# Altium project AMC_BOX_Panel.PrjPCB (part 2 of 2)

## Sheet IO.SchDoc
size A3
Used 2 times, as channels U_IO, U_IO. Parts and nets are listed once, with the designators drawn on the sheet.
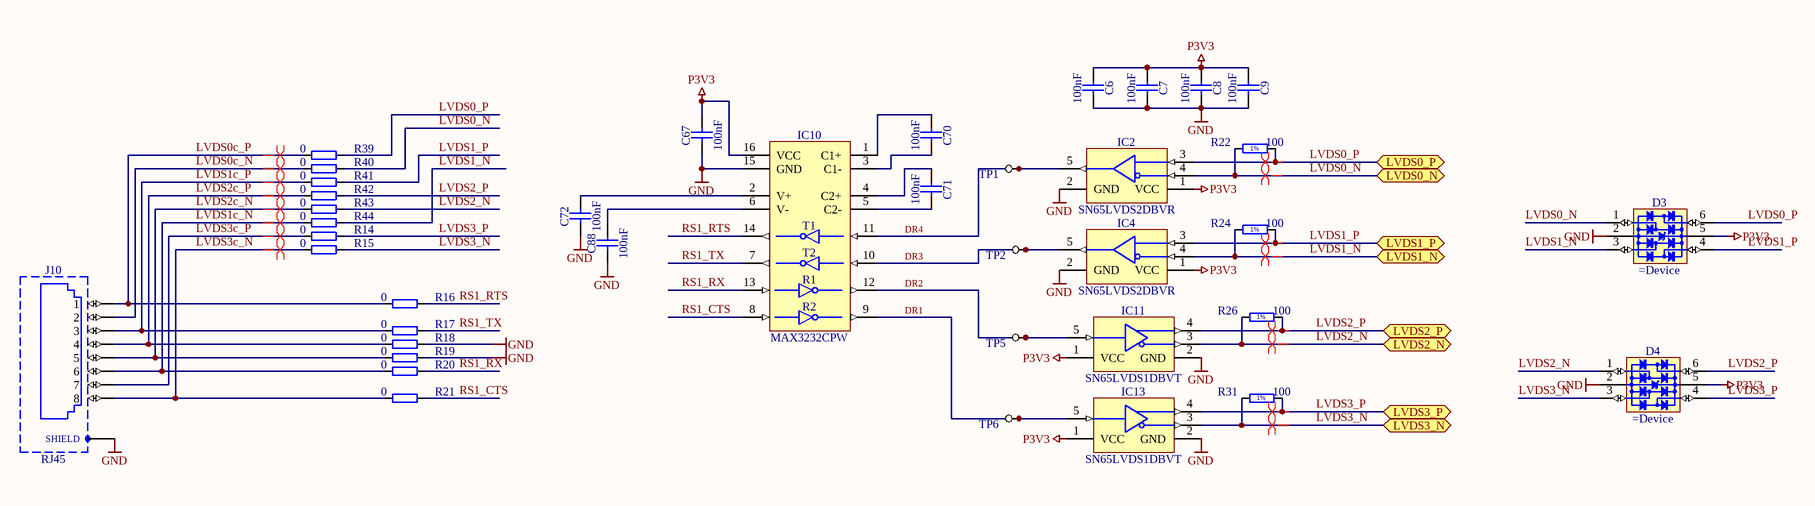
[diagram p4: IO.SchDoc]

### Parts
C6  100nF  [CAPC1005X55N]
C7  100nF  [CAPC1005X55N]
C8  100nF  [CAPC1005X55N]
C9  100nF  [CAPC1005X55N]
C67  100nF  [CAPC1005X55N]
C70  100nF  [CAPC1005X55N]
C71  100nF  [CAPC1005X55N]
C72  100nF  [CAPC1005X55N]
C88  100nF  [CAPC1005X55N]
D3  (no value)  [SOTFL50P160X60-6N]
D4  (no value)  [SOTFL50P160X60-6N]
IC2  SN65LVDS2DBVR  [SOT95P280X145-5N]
IC4  SN65LVDS2DBVR  [SOT95P280X145-5N]
IC10  MAX3232CPW  [SOP65P640X120-16N]
IC11  SN65LVDS1DBVT  [SOT95P280X145-5N]
IC13  SN65LVDS1DBVT  [SOT95P280X145-5N]
J10  RJ45  [FCI_95678-001LF]
R14  0  [RESC1005X40N]
R15  0  [RESC1005X40N]
R16  0  [RESC1005X40N]
R17  0  [RESC1005X40N]
R18  0  [RESC1005X40N]
R19  0  [RESC1005X40N]
R20  0  [RESC1005X40N]
R21  0  [RESC1005X40N]
R22  100  [RESC1005X40N]
R24  100  [RESC1005X40N]
R26  100  [RESC1005X40N]
R31  100  [RESC1005X40N]
R39  0  [RESC1005X40N]
R40  0  [RESC1005X40N]
R41  0  [RESC1005X40N]
R42  0  [RESC1005X40N]
R43  0  [RESC1005X40N]
R44  0  [RESC1005X40N]
TP1  TP  [TP]  (value not drawn)
TP2  TP  [TP]  (value not drawn)
TP5  TP  [TP]  (value not drawn)
TP6  TP  [TP]  (value not drawn)

### Ports
LVDS0_N (bidir), LVDS0_P (bidir), LVDS1_N (bidir), LVDS1_P (bidir), LVDS2_N (bidir), LVDS2_P (bidir), LVDS3_N (bidir), LVDS3_P (bidir)

### Nets
GND: C6.1 C7.1 C8.1 C9.1 C67.1 C72.2 C88.2 D3.2(GND) D4.2(GND) IC2.2(GND) IC4.2(GND) IC10.15(GND) IC11.2(GND) IC13.2(GND) J10.SHIELD R18.2 R19.2
P3V3: C6.2 C7.2 C8.2 C9.2 C67.2 D3.5(VBUS) D4.5(VBUS) IC2.1(VCC) IC4.1(VCC) IC10.16(VCC) IC11.1(VCC) IC13.1(VCC)
DR1: IC10.9(R2OUT) IC13.5(R) TP6.1
DR2: IC10.12(R1OUT) IC11.5(R) TP5.1
DR3: IC4.5(R) IC10.10(T2IN) TP2.1
DR4: IC2.5(R) IC10.11(T1IN) TP1.1
LVDS0_N: D3.1(I/O1) IC2.4(B) R22.1 R40.2 ; port LVDS0_N
LVDS0_P: D3.6(I/O4) IC2.3(A) R22.2 R39.2 ; port LVDS0_P
LVDS0c_N: J10.2 R40.1
LVDS0c_P: J10.1 R16.1 R39.1
LVDS1_N: D3.3(I/O2) IC4.4(B) R24.1 R44.2 ; port LVDS1_N
LVDS1_P: D3.4(I/O3) IC4.3(A) R24.2 R41.2 ; port LVDS1_P
LVDS1c_N: J10.6 R20.1 R44.1
LVDS1c_P: J10.3 R17.1 R41.1
LVDS2_N: D4.1(I/O1) IC11.3(A) R26.1 R43.2 ; port LVDS2_N
LVDS2_P: D4.6(I/O4) IC11.4(B) R26.2 R42.2 ; port LVDS2_P
LVDS2c_N: J10.5 R19.1 R43.1
LVDS2c_P: J10.4 R18.1 R42.1
LVDS3_N: D4.3(I/O2) IC13.3(A) R15.2 R31.1 ; port LVDS3_N
LVDS3_P: D4.4(I/O3) IC13.4(B) R14.2 R31.2 ; port LVDS3_P
LVDS3c_N: J10.8 R15.1 R21.1
LVDS3c_P: J10.7 R14.1
RS1_CTS: IC10.8(R2IN) R21.2
RS1_RTS: IC10.14(T1OUT) R16.2
RS1_RX: IC10.13(R1IN) R20.2
RS1_TX: IC10.7(T2OUT) R17.2
NetC70_1: C70.1 IC10.3(C1-)
NetC70_2: C70.2 IC10.1(C1+)
NetC71_1: C71.1 IC10.5(C2-)
NetC71_2: C71.2 IC10.4(C2+)
NetC72_1: C72.1 IC10.2(V+)
NetC88_1: C88.1 IC10.6(V-)

### Channels
U_IO: designators end in A; ports LVDS0_N=LVDS0_N LVDS0_P=LVDS0_P LVDS1_N=LVDS1_N LVDS1_P=LVDS1_P LVDS2_N=LVDS2_N LVDS2_P=LVDS2_P LVDS3_N=LVDS3_N LVDS3_P=LVDS3_P
U_IO: designators end in B; ports LVDS0_N=LVDS0_N LVDS0_P=LVDS0_P LVDS1_N=LVDS1_N LVDS1_P=LVDS1_P LVDS2_N=LVDS2_N LVDS2_P=LVDS2_P LVDS3_N=LVDS3_N LVDS3_P=LVDS3_P

### Layout directives
differential pair: LVDS0_N, LVDS0_P, LVDS0c_N_U_IO, LVDS0c_P_U_IO, LVDS1_N, LVDS1_P, LVDS1c_N_U_IO, LVDS1c_P_U_IO, LVDS2_N, LVDS2_P, LVDS2c_N_U_IO, LVDS2c_P_U_IO, LVDS3_N, LVDS3_P, LVDS3c_N_U_IO, LVDS3c_P_U_IO

### Notes on the sheet
- (in symbol MAX3232CPW) T1; T2; R1; R2
- (in symbol R0402_100R_1%_0.0625W_100PPM) 1%

### Library data of the parts
C6-C9 C67 C70-C72 C88 = CC0402_100NF_16V_10%_X5R: Non-polarised capacitor; Part Description: SMD Multilayer Chip Ceramic Capacitor; Manufacturer: GENERIC; Manufacturer1 Part Number: GRM155R61C104KA88D; Voltage: 16V; TC: X5R; Tolerance: ±10%; Part Number: CC0402_100NF_16V_10%_X5R; Component Kind: Standard; Component Type: Standard; Pin Count: 2; Value: 100nF; Status: None; Manufacturer Part Number: CC0402_100NF_16V_10%_X5R; Case: 0402; Mounted: Yes; Socket: No; SMD: Yes; Manufacturer1 Example: MURATA; Manufacturer1 ComponentHeight: 0.55mm; HelpURL: \\cern.ch\dfs\Applications\Altium\Datasheets\CC0402_X5R_MURATA_GRM.pdf; Author: CERN DEM JLC; CreateDate: 10.12.2013; LatestRevisionDate: 10.12.2013; Sense: No
D3 D4 = NUP4114UPXV6T1G: Part Number: NUP4114UPXV6T1G
IC2 IC4 = SN65LVDS2DBVR: High-Speed Differential Line Receiver; Manufacturer: TEXAS INSTRUMENTS; PressFit: No; Bonding: No; Part Number: SN65LVDS2DBVR; Component Kind: Standard; Component Type: Standard; Device: SN65LVDS2DBVR; PackageDescription: SOT, 0.95mm pitch; 5 pin, 1.60mm W X 2.90mm L X 1.45mm H body, IPC Medium Density; Part Description: High-Speed Differential Line Receiver; Manufacturer Part Number: SN65LVDS2DBVR; Pin Count: 5; Case: SOT23-5; Mounted: Yes; Socket: No; SMD: Yes; Sense: No; ComponentHeight: 1.45mm; Author: CERN DEM JLC; HelpURL: \\cern.ch\dfs\Applications\Altium\Datasheets\SN65LVDS2DBVR.pdf; CreateDate: 03.03.2011; LatestRevisionDate: 22.09.2011
IC10 = MAX3232CPW: 3-V To 5.5-V Multichannel RS-232 Line Driver/Receiver With ±15kV IEC ESD Protection; Part Description: 3V To 5.5V Multichannel RS-232 Line Driver/Receiver With ±15kV IEC ESD Protection; Manufacturer: TEXAS INSTRUMENTS; Table: Analog & Interface; Part Number: MAX3232CPW; Component Kind: Standard; Component Type: Standard; Device: MAX3232CPW; PackageDescription: SOP, 0.65mm pitch; 16 pin, 4.40mm W X 5.00mm L X 1.20mm H body IPC Medium Density; Manufacturer Part Number: MAX3232CPW; Pin Count: 16; Case: TSSOP16; Mounted: Yes; Socket: No; SMD: Yes; ComponentHeight: 1.2mm; Author: CERN DEM JLC; HelpURL: \\cern.ch\dfs\Applications\Altium\Datasheets\MAX3232CPW.pdf; CreateDate: 2012-01-09; LatestRevisionDate: 2012-01-10
IC11 IC13 = SN65LVDS1DBVT: High-Speed Differential Line Driver; Manufacturer: TEXAS INSTRUMENTS; PressFit: No; Bonding: No; Part Number: SN65LVDS1DBVT; Component Kind: Standard; Component Type: Standard; Device: SN65LVDS1DBVT; PackageDescription: SOT, 0.95mm pitch; 5 pin, 1.60mm W X 2.90mm L X 1.45mm H body, IPC Medium Density; Part Description: High-Speed Differential Line Driver; Manufacturer Part Number: SN65LVDS1DBVT; Pin Count: 5; Case: SOT23-5; Mounted: Yes; Socket: No; SMD: Yes; Sense: No; ComponentHeight: 1.45mm; Author: CERN DEM JLC; HelpURL: \\cern.ch\dfs\Applications\Altium\Datasheets\SN65LVDS1DBVT.pdf; CreateDate: 22.09.2011; LatestRevisionDate: 22.09.2011
J10 = FCI_95678-001LF: 1 Port, 8 Positions Shielded Snap PEG, CAT5 RJ45 Horizontal Modular Jack; Manufacturer: FCI; PressFit: No; Part Number: FCI_95678-001LF; Component Kind: Standard; Component Type: Standard; Pin Count: 10; Family: RJ45; Mounted: Yes; Socket: No; SMD: No; Sense: No; Status: None; Part Description: 1 Port, 8 Positions Shielded Snap PEG, CAT5 RJ45 Horizontal Modular Jack; Manufacturer Part Number: 95678-001LF; ComponentHeight: 13.99mm; HelpURL: \\cern.ch\dfs\Applications\Altium\Datasheets\FCI_95678-001LF.pdf; Author: CERN DEM BC; CreateDate: 28.07.2015; LatestRevisionDate: 28.07.2015
R14-R21 R39-R44 = R0402_0R_JUMPER: Resistor; Part Description: 1A (0.05R Max DC Resistance) Zero Ohm Jumper; Manufacturer: GENERIC; Manufacturer1 Part Number: 232270591001L; Table: Resistors SMD; Part Number: R0402_0R_JUMPER; Component Kind: Standard; Component Type: Standard; Pin Count: 2; Value: 0; Status: Not recommended; Manufacturer Part Number: R0402_0R_JUMPER; Case: 0402; Mounted: Yes; Socket: No; SMD: Yes; Manufacturer1 Example: YAGEO PHYCOMP; Manufacturer1 ComponentHeight: 0.4mm; HelpURL: \\cern.ch\dfs\Applications\Altium\Datasheets\R0402_Phycomp_RC0402.pdf; Author: CERN DEM JLC; CreateDate: 2007-12-03; LatestRevisionDate: 2012-10-17
R22 R24 R26 R31 = R0402_100R_1%_0.0625W_100PPM: Resistor - 1%; Part Description: General Purpose Thick Film Chip Resistor; Manufacturer: GENERIC; Manufacturer1 Part Number: 232270671001L; TC: ±100ppm/°C; Table: Resistors SMD; Part Number: R0402_100R_1%_0.0625W_100PPM; Component Kind: Standard; Component Type: Standard; Pin Count: 2; Value: 100; Status: Not recommended; Power: 0.0625W; Tolerance: ±1%; Manufacturer Part Number: R0402_100R_1%_0.0625W_100PPM; Case: 0402; Mounted: Yes; Socket: No; SMD: Yes; Manufacturer1 Example: YAGEO PHYCOMP; Manufacturer1 ComponentHeight: 0.4mm; HelpURL: \\cern.ch\dfs\Applications\Altium\Datasheets\R0402_Phycomp_RC0402.pdf; Author: CERN DEM JLC; CreateDate: 2007-12-03; LatestRevisionDate: 2012-10-17
TP1 TP2 TP5 TP6 = TP: Testpoint

## Sheet I2C_SW.SchDoc
size A4; Organization: Altium Limited; Address1: L3, 12a Rodborough Rd; Address2: Frenchs Forest; Address3: NSW; Address4: Australia 2086
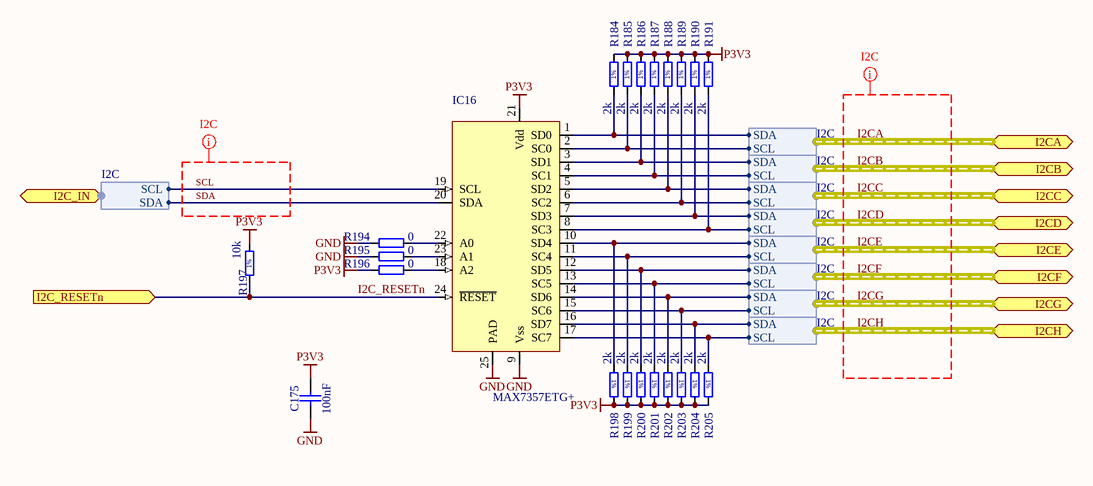
[diagram p5: I2C_SW.SchDoc]

### Parts
C175  100nF  [CAPC1005X55N]
IC16  MAX7357ETG+  [HVQFN24]
R184  2k  [RESC1005X40N]
R185  2k  [RESC1005X40N]
R186  2k  [RESC1005X40N]
R187  2k  [RESC1005X40N]
R188  2k  [RESC1005X40N]
R189  2k  [RESC1005X40N]
R190  2k  [RESC1005X40N]
R191  2k  [RESC1005X40N]
R194  0  [RESC1005X40N]
R195  0  [RESC1005X40N]
R196  0  [RESC1005X40N]
R197  10k  [RESC1005X40N]
R198  2k  [RESC1005X40N]
R199  2k  [RESC1005X40N]
R200  2k  [RESC1005X40N]
R201  2k  [RESC1005X40N]
R202  2k  [RESC1005X40N]
R203  2k  [RESC1005X40N]
R204  2k  [RESC1005X40N]
R205  2k  [RESC1005X40N]

### Ports
I2C_IN (harness I2C), I2C_RESETn (in), I2CA (harness I2C), I2CB (harness I2C), I2CC (harness I2C), I2CD (harness I2C), I2CE (harness I2C), I2CF (harness I2C), I2CG (harness I2C), I2CH (harness I2C)

### Harnesses
I2C: SCL, SDA

### Nets
GND: C175.1 IC16.9(Vss) IC16.25(PAD) R194.1 R195.1
P3V3: C175.2 IC16.21(Vdd) R184.2 R185.2 R186.2 R187.2 R188.2 R189.2 R190.2 R191.2 R196.1 R197.2 R198.2 R199.2 R200.2 R201.2 R202.2 R203.2 R204.2 R205.2
I2C_RESETn: IC16.24(~{RESET}) R197.1 ; port I2C_RESETn
I2CA.SCL: IC16.2(SC0) R185.1 ; port I2CA.SCL
I2CA.SDA: IC16.1(SD0) R184.1 ; port I2CA.SDA
I2CB.SCL: IC16.4(SC1) R187.1 ; port I2CB.SCL
I2CB.SDA: IC16.3(SD1) R186.1 ; port I2CB.SDA
I2CC.SCL: IC16.6(SC2) R189.1 ; port I2CC.SCL
I2CC.SDA: IC16.5(SD2) R188.1 ; port I2CC.SDA
I2CD.SCL: IC16.8(SC3) R191.1 ; port I2CD.SCL
I2CD.SDA: IC16.7(SD3) R190.1 ; port I2CD.SDA
I2CE.SCL: IC16.11(SC4) R199.1 ; port I2CE.SCL
I2CE.SDA: IC16.10(SD4) R198.1 ; port I2CE.SDA
I2CF.SCL: IC16.13(SC5) R201.1 ; port I2CF.SCL
I2CF.SDA: IC16.12(SD5) R200.1 ; port I2CF.SDA
I2CG.SCL: IC16.15(SC6) R203.1 ; port I2CG.SCL
I2CG.SDA: IC16.14(SD6) R202.1 ; port I2CG.SDA
I2CH.SCL: IC16.17(SC7) R205.1 ; port I2CH.SCL
I2CH.SDA: IC16.16(SD7) R204.1 ; port I2CH.SDA
SCL: IC16.19(SCL) ; port I2C_IN.SCL  [project net MSCL_L]
SDA: IC16.20(SDA) ; port I2C_IN.SDA  [project net MSDA_L]
NetIC16_18: IC16.18(A2) R196.2
NetIC16_22: IC16.22(A0) R194.2
NetIC16_23: IC16.23(A1) R195.2

### Buses and harness runs
harness I2CA = port I2CA
harness I2CB = port I2CB
harness I2CC = port I2CC
harness I2CD = port I2CD
harness I2CE = port I2CE
harness I2CF = port I2CF
harness I2CG = port I2CG
harness I2CH = port I2CH

### Layout directives
net class I2C: I2CA, I2CB, I2CC, I2CD, I2CE, I2CF, I2CG, I2CH, SCL, SDA

### Notes on the sheet
- (in symbol R0402_2K_1%_0.0625W_100PPM) 1%
- (in symbol R0402_10K_1%_0.0625W_100PPM) 1%

### Library data of the parts
C175 = CC0402_100NF_16V_10%_X5R: as C6 on sheet IO; Part Number: CC0402_100NF_16V_10%_X5R; Component Kind: Standard; Component Type: Standard; Pin Count: 2; Value: 100nF; Status: None; Manufacturer Part Number: CC0402_100NF_16V_10%_X5R; Case: 0402; Mounted: Yes; Socket: No; SMD: Yes; Manufacturer1 Example: MURATA; Manufacturer1 ComponentHeight: 0.55mm; HelpURL: \\cern.ch\dfs\Applications\Altium\Datasheets\CC0402_X5R_MURATA_GRM.pdf; Author: CERN DEM JLC; CreateDate: 10.12.2013; LatestRevisionDate: 10.12.2013; Sense: No
IC16 = IIC_MUX_MAX7357ETG+: 8-channel I2C-bus multiplexer with reset, INT and timeout
R184-R191 R198-R205 = R0402_2K_1%_0.0625W_100PPM: Resistor - 1%; Part Description: General Purpose Thick Film Chip Resistor; Manufacturer: GENERIC; Manufacturer1 Part Number: 232270672002L; TC: ±100ppm/°C; PressFit: No; Part Number: R0402_2K_1%_0.0625W_100PPM; Component Kind: Standard; Component Type: Standard; Pin Count: 2; Value: 2k; Status: Not Recommended; Power: 0.0625W; Tolerance: ±1%; Manufacturer Part Number: R0402_2K_1%_0.0625W_100PPM; Case: 0402; Mounted: Yes; Socket: No; SMD: Yes; Manufacturer1 Example: YAGEO PHYCOMP; Manufacturer1 ComponentHeight: 0.4mm; HelpURL: \\cern.ch\dfs\Applications\Altium\Datasheets\R0402_Phycomp_RC0402.pdf; Author: CERN DEM JLC; CreateDate: 03.12.2007; LatestRevisionDate: 17.10.2012; Sense: No
R194-R196 = R0402_0R_JUMPER: Resistor; Part Description: 1A (0.05R Max DC Resistance) Zero Ohm Jumper; Manufacturer: GENERIC; Manufacturer1 Part Number: 232270591001L; PressFit: No; Part Number: R0402_0R_JUMPER; Component Kind: Standard; Component Type: Standard; Pin Count: 2; Value: 0; Status: Not Recommended; Manufacturer Part Number: R0402_0R_JUMPER; Case: 0402; Mounted: Yes; Socket: No; SMD: Yes; Manufacturer1 Example: YAGEO PHYCOMP; Manufacturer1 ComponentHeight: 0.4mm; HelpURL: \\cern.ch\dfs\Applications\Altium\Datasheets\R0402_Phycomp_RC0402.pdf; Author: CERN DEM JLC; CreateDate: 03.12.2007; LatestRevisionDate: 17.10.2012; Sense: No
R197 = R0402_10K_1%_0.0625W_100PPM: Resistor - 1%; Part Description: General Purpose Thick Film Chip Resistor; Manufacturer: GENERIC; Manufacturer1 Part Number: 232270671003L; TC: ±100ppm/°C; Table: Resistors SMD; Part Number: R0402_10K_1%_0.0625W_100PPM; Component Kind: Standard; Component Type: Standard; Pin Count: 2; Value: 10k; Status: Not recommended; Power: 0.0625W; Tolerance: ±1%; Manufacturer Part Number: R0402_10K_1%_0.0625W_100PPM; Case: 0402; Mounted: Yes; Socket: No; SMD: Yes; Manufacturer1 Example: YAGEO PHYCOMP; Manufacturer1 ComponentHeight: 0.4mm; HelpURL: \\cern.ch\dfs\Applications\Altium\Datasheets\R0402_Phycomp_RC0402.pdf; Author: CERN DEM JLC; CreateDate: 2007-12-03; LatestRevisionDate: 2012-10-17

## Sheet Thermal_MGT.SchDoc
size A4
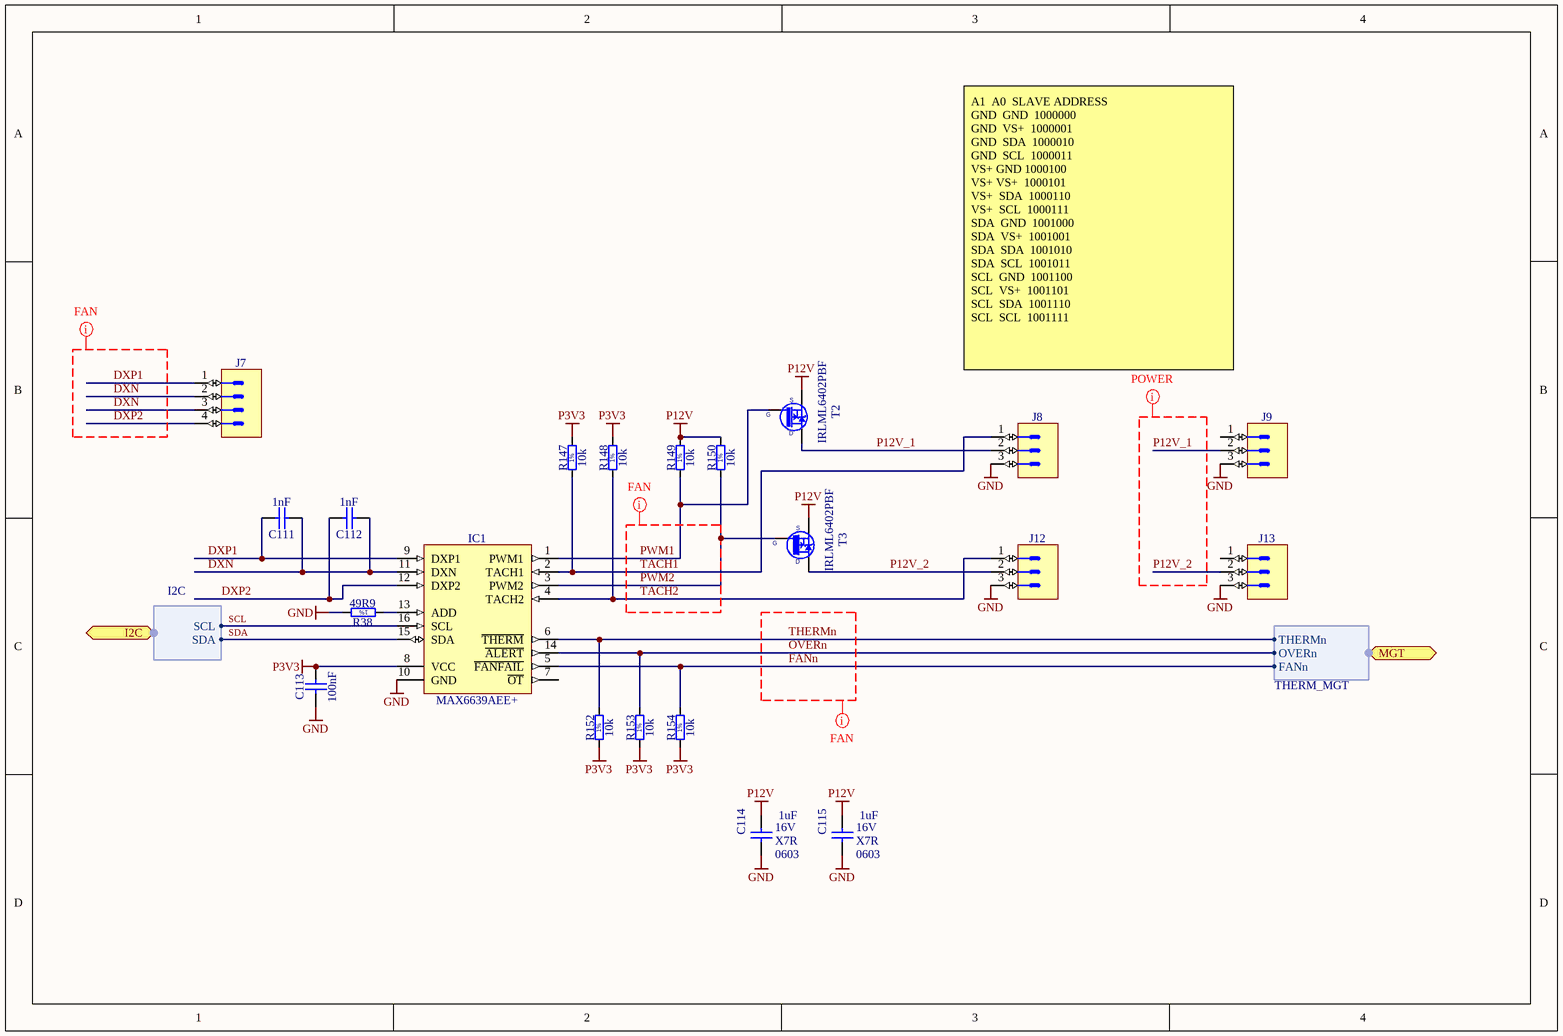
[diagram p6: Thermal_MGT.SchDoc]

### Parts
C111  1nF  [CAPC1005X55N]
C112  1nF  [CAPC1005X55N]
C113  100nF  [CAPC1005X55N]
C114  1uF  Voltage: 16V  TC: X7R  Case: 0603  [CAPC1608X87N]
C115  1uF  Voltage: 16V  TC: X7R  Case: 0603  [CAPC1608X87N]
IC1  MAX6639AEE+  [SOP63P600X175-16N]
J7  KK®  [MOLEX_22-27-2041]  (value not drawn)
J8  KK®  [MOLEX_22-05-7038]  (value not drawn)
J9  KK®  [MOLEX_22-05-7038]  (value not drawn)
J12  KK®  [MOLEX_22-05-7038]  (value not drawn)
J13  KK®  [MOLEX_22-05-7038]  (value not drawn)
R38  49R9  [RESC1005X40N]
R147  10k  [RESC1005X40N]
R148  10k  [RESC1005X40N]
R149  10k  [RESC1005X40N]
R150  10k  [RESC1005X40N]
R152  10k  [RESC1005X40N]
R153  10k  [RESC1005X40N]
R154  10k  [RESC1005X40N]
T2  IRLML6402PBF  [SOT95P237X112-3N]
T3  IRLML6402PBF  [SOT95P237X112-3N]

### Ports
I2C (harness I2C), MGT (harness THERM_MGT)

### Harnesses
I2C: SCL, SDA
THERM_MGT: OVERn, THERMn, FANn

### Nets
GND: C113.1 C114.1 C115.1 IC1.10(GND) J8.3 J9.3 J12.3 J13.3 R38.2
P3V3: C113.2 IC1.8(VCC) R147.2 R148.2 R152.1 R153.1 R154.1
P12V: C114.2 C115.2 R149.2 R150.2 T2.2(S) T3.2(S)
DXN: C111.1 C112.1 IC1.11(DXN) J7.2 J7.3
DXP1: C111.2 IC1.9(DXP1) J7.1
DXP2: C112.2 IC1.12(DXP2) J7.4
FANn: IC1.5(~{FANFAIL}) R154.2 ; port MGT.FANn
OVERn: IC1.14(~{ALERT}) R153.2 ; port MGT.OVERn
P12V_1: J8.2 J9.2 T2.3(D)
P12V_2: J12.2 J13.2 T3.3(D)
PWM1: IC1.1(PWM1) R149.1 T2.1(G)
PWM2: IC1.3(PWM2) R150.1 T3.1(G)
SCL: IC1.16(SCL) ; port I2C.SCL  [project net I2CH.SCL]
SDA: IC1.15(SDA) ; port I2C.SDA  [project net I2CH.SDA]
TACH1: IC1.2(TACH1) J8.1 R147.1
TACH2: IC1.4(TACH2) J12.1 R148.1
THERMn: IC1.6(~{THERM}) R152.2 ; port MGT.THERMn
NetIC1_13: IC1.13(ADD) R38.1

Not connected (* = marked no-connect by the designer): IC1 7(~{OT}); J9 1; J13 1

### Layout directives
net class POWER: P12V_1, P12V_2
net class FAN: DXN, DXP1, DXP2, FANn, OVERn, PWM1, PWM2, TACH1, TACH2, THERMn

### Notes on the sheet
- A1 	A0 	SLAVE ADDRESS
  GND 	GND 	1000000
  GND 	VS+ 	1000001
  GND 	SDA 	1000010
  GND 	SCL 	1000011
  VS+	GND	1000100
  VS+	VS+ 	1000101
  VS+ 	SDA 	1000110
  VS+ 	SCL 	1000111
  SDA 	GND 	1001000
  SDA 	VS+ 	1001001
  SDA 	SDA 	1001010
  SDA 	SCL 	1001011
  SCL 	GND 	1001100
  SCL 	VS+ 	1001101
  SCL 	SDA 	1001110
  SCL 	SCL 	1001111
- (in symbol R0402_10K_1%_0.0625W_100PPM) 1%
- (in symbol R0402_49R9_1%_0.0625W_100PPM) 1%

### Library data of the parts
C111 C112 = CC0402_1NF_50V_10%_X7R: Non-polarised capacitor; Part Description: SMD Multilayer Chip Ceramic Capacitor; Manufacturer: GENERIC; Manufacturer1 Part Number: 223858715623; Voltage: 50V; TC: X7R; Tolerance: ±10%; Part Number: CC0402_1NF_50V_10%_X7R; Component Kind: Standard; Component Type: Standard; Pin Count: 2; Value: 1nF; Status: Not Recommended; Manufacturer Part Number: CC0402_1NF_50V_10%_X7R; Case: 0402; Mounted: Yes; Socket: No; SMD: Yes; Manufacturer1 Example: PHYCOMP; Manufacturer1 ComponentHeight: 0.55mm; HelpURL: \\cern.ch\dfs\Applications\Altium\Datasheets\CC0402_X7R_PHYCOMP.pdf; Author: CERN DEM JLC; CreateDate: 03.12.2007; LatestRevisionDate: 03.12.2007; Sense: No
C113 = CC0402_100NF_16V_10%_X5R: as C6 on sheet IO; Part Number: CC0402_100NF_16V_10%_X5R; Component Kind: Standard; Component Type: Standard; Pin Count: 2; Value: 100nF; Status: None; Manufacturer Part Number: CC0402_100NF_16V_10%_X5R; Case: 0402; Mounted: Yes; Socket: No; SMD: Yes; Manufacturer1 Example: MURATA; Manufacturer1 ComponentHeight: 0.55mm; HelpURL: \\cern.ch\dfs\Applications\Altium\Datasheets\CC0402_X5R_MURATA_GRM.pdf; Author: CERN DEM JLC; CreateDate: 10.12.2013; LatestRevisionDate: 10.12.2013; Sense: No
C114 C115 = CC0603_1UF_16V_10%_X7R: Non-polarised capacitor; Part Description: SMD Multilayer Chip Ceramic Capacitor; Manufacturer: GENERIC; Manufacturer1 Part Number: 223824613663; Tolerance: ±10%; Table: Capacitors SMD; Part Number: CC0603_1UF_16V_10%_X7R; Component Kind: Standard; Component Type: Standard; Pin Count: 2; Value: 1uF; Status: Preferred; Manufacturer Part Number: CC0603_1uF_16V_10%_X7R; Mounted: Yes; Socket: No; SMD: Yes; Manufacturer1 Example: PHYCOMP; Manufacturer1 ComponentHeight: 0.87mm; HelpURL: \\cern.ch\dfs\Applications\Altium\Datasheets\CC0805_X5R_PHYCOMP_HC.pdf; Author: CERN DEM JLC; CreateDate: 12/3/2007; LatestRevisionDate: 12/3/2007
IC1 = MAX6639AEE+: 2-Channel Temperature Monitor with Dual, Automatic, PWM Fan-Speed Controller; Manufacturer: MAXIM; Table: Analog & Interface; Part Number: MAX6639AEE+; Component Kind: Standard; Component Type: Standard; Device: MAX6639AEE+; PackageDescription: SOP, 0.635mm pitch; 16 pin, 3.9mm W X 4.895mm L X 1.75mm H Body, IPC Medium Density; Part Description: 2-Channel Temperature Monitor with Dual, Automatic, PWM Fan-Speed Controller; Manufacturer Part Number: MAX6639AEE+; Pin Count: 16; Case: SSOP16; Mounted: Yes; Socket: No; SMD: Yes; ComponentHeight: 1.75mm; Author: CERN DEM JLC; HelpURL: \\cern.ch\dfs\Applications\Altium\Datasheets\MAX6639AEE+.pdf; CreateDate: 2012-08-15; LatestRevisionDate: 2012-08-15
J7 = MOLEX_22-27-2041: Connector 4 Male; Part Description: 2.54mm (.100") Pitch KK® Wire-to-Board Header, Vertical, with Friction Lock, 4 Circuits, Tin (Sn) Plating; Manufacturer: MOLEX; PressFit: No; Part Number: MOLEX_22-27-2041; Component Kind: Standard; Component Type: Standard; Pin Count: 4; Family: KK®; Mounted: Yes; Socket: No; SMD: No; Sense: No; Status: None; Manufacturer Part Number: 22-27-2041; ComponentHeight: 11.7mm; HelpURL: \\cern.ch\dfs\Applications\Altium\Datasheets\MOLEX_22-27-2041.pdf; Author: CERN DEM JLC; CreateDate: 04.12.2008; LatestRevisionDate: 04.12.2008
J8 J9 J12 J13 = MOLEX_22-05-7038: Connector 3 Male; Part Description: 2.54mm (.100") Pitch KK® Wire-To-Board Header, Right Angle, With Friction Lock, 3 Circuits; Manufacturer: MOLEX; PressFit: No; Part Number: MOLEX_22-05-7038; Component Kind: Standard; Component Type: Standard; Pin Count: 3; Family: KK®; Mounted: Yes; Socket: No; SMD: No; Sense: No; Status: None; Manufacturer Part Number: 22-05-7038; ComponentHeight: 5.8mm; HelpURL: \\cern.ch\dfs\Applications\Altium\Datasheets\MOLEX_22-05-7038.pdf; Author: CERN DEM JLC; CreateDate: 19.09.2012; LatestRevisionDate: 19.09.2012
R38 = R0402_49R9_1%_0.0625W_100PPM: Resistor - 1%; Part Description: General Purpose Thick Film Chip Resistor; Manufacturer: GENERIC; Manufacturer1 Part Number: 232270674999L or RC0402FR-0749R9L; TC: ±100ppm/°C; Table: Resistors SMD; Part Number: R0402_49R9_1%_0.0625W_100PPM; Component Kind: Standard; Component Type: Standard; Pin Count: 2; Value: 49R9; Status: Not recommended; Power: 0.0625W; Tolerance: ±1%; Manufacturer Part Number: R0402_49R9_1%_0.0625W_100PPM; Case: 0402; Mounted: Yes; Socket: No; SMD: Yes; Manufacturer1 Example: YAGEO PHYCOMP; Manufacturer1 ComponentHeight: 0.4mm; HelpURL: \\cern.ch\dfs\Applications\Altium\Datasheets\R0402_Phycomp_RC0402.pdf; Author: CERN DEM JLC; CreateDate: 2012-10-24; LatestRevisionDate: 2012-10-24
R147-R150 R152-R154 = R0402_10K_1%_0.0625W_100PPM: as R197 on sheet I2C_SW; Part Number: R0402_10K_1%_0.0625W_100PPM; Component Kind: Standard; Component Type: Standard; Pin Count: 2; Value: 10k; Status: Not recommended; Power: 0.0625W; Tolerance: ±1%; Manufacturer Part Number: R0402_10K_1%_0.0625W_100PPM; Case: 0402; Mounted: Yes; Socket: No; SMD: Yes; Manufacturer1 Example: YAGEO PHYCOMP; Manufacturer1 ComponentHeight: 0.4mm; HelpURL: \\cern.ch\dfs\Applications\Altium\Datasheets\R0402_Phycomp_RC0402.pdf; Author: CERN DEM JLC; CreateDate: 2007-12-03; LatestRevisionDate: 2012-10-17
T2 T3 = IRLML6402PBF: P-CHANNEL MOSFET WITH ZENER DIODE; Part Description: -20V -3.7A P-Channel HEXFET® Power MOSFET; Manufacturer: INTERNATIONAL RECTIFIER; PressFit: No; Bonding: No; Part Number: IRLML6402PBF; Component Kind: Standard; Component Type: Standard; Device: IRLML6402PBF; PackageDescription: SOT, 0.95mm, pitch; 3 pin,1.30mm W X 2.92mm L X 1.12mm H body, IPC Medium Density; Manufacturer Part Number: IRLML6402PBF; Pin Count: 3; Case: SOT23-3; Mounted: Yes; Socket: No; SMD: Yes; Sense: No; ComponentHeight: 1.12mm; HelpURL: \\cern.ch\dfs\Applications\Altium\Datasheets\IRLML6402PBF.pdf; Author: CERN DEM JLC; CreateDate: 8/29/2011; LatestRevisionDate: 8/29/2011

## Sheet CPU_ETH.SchDoc
size A3
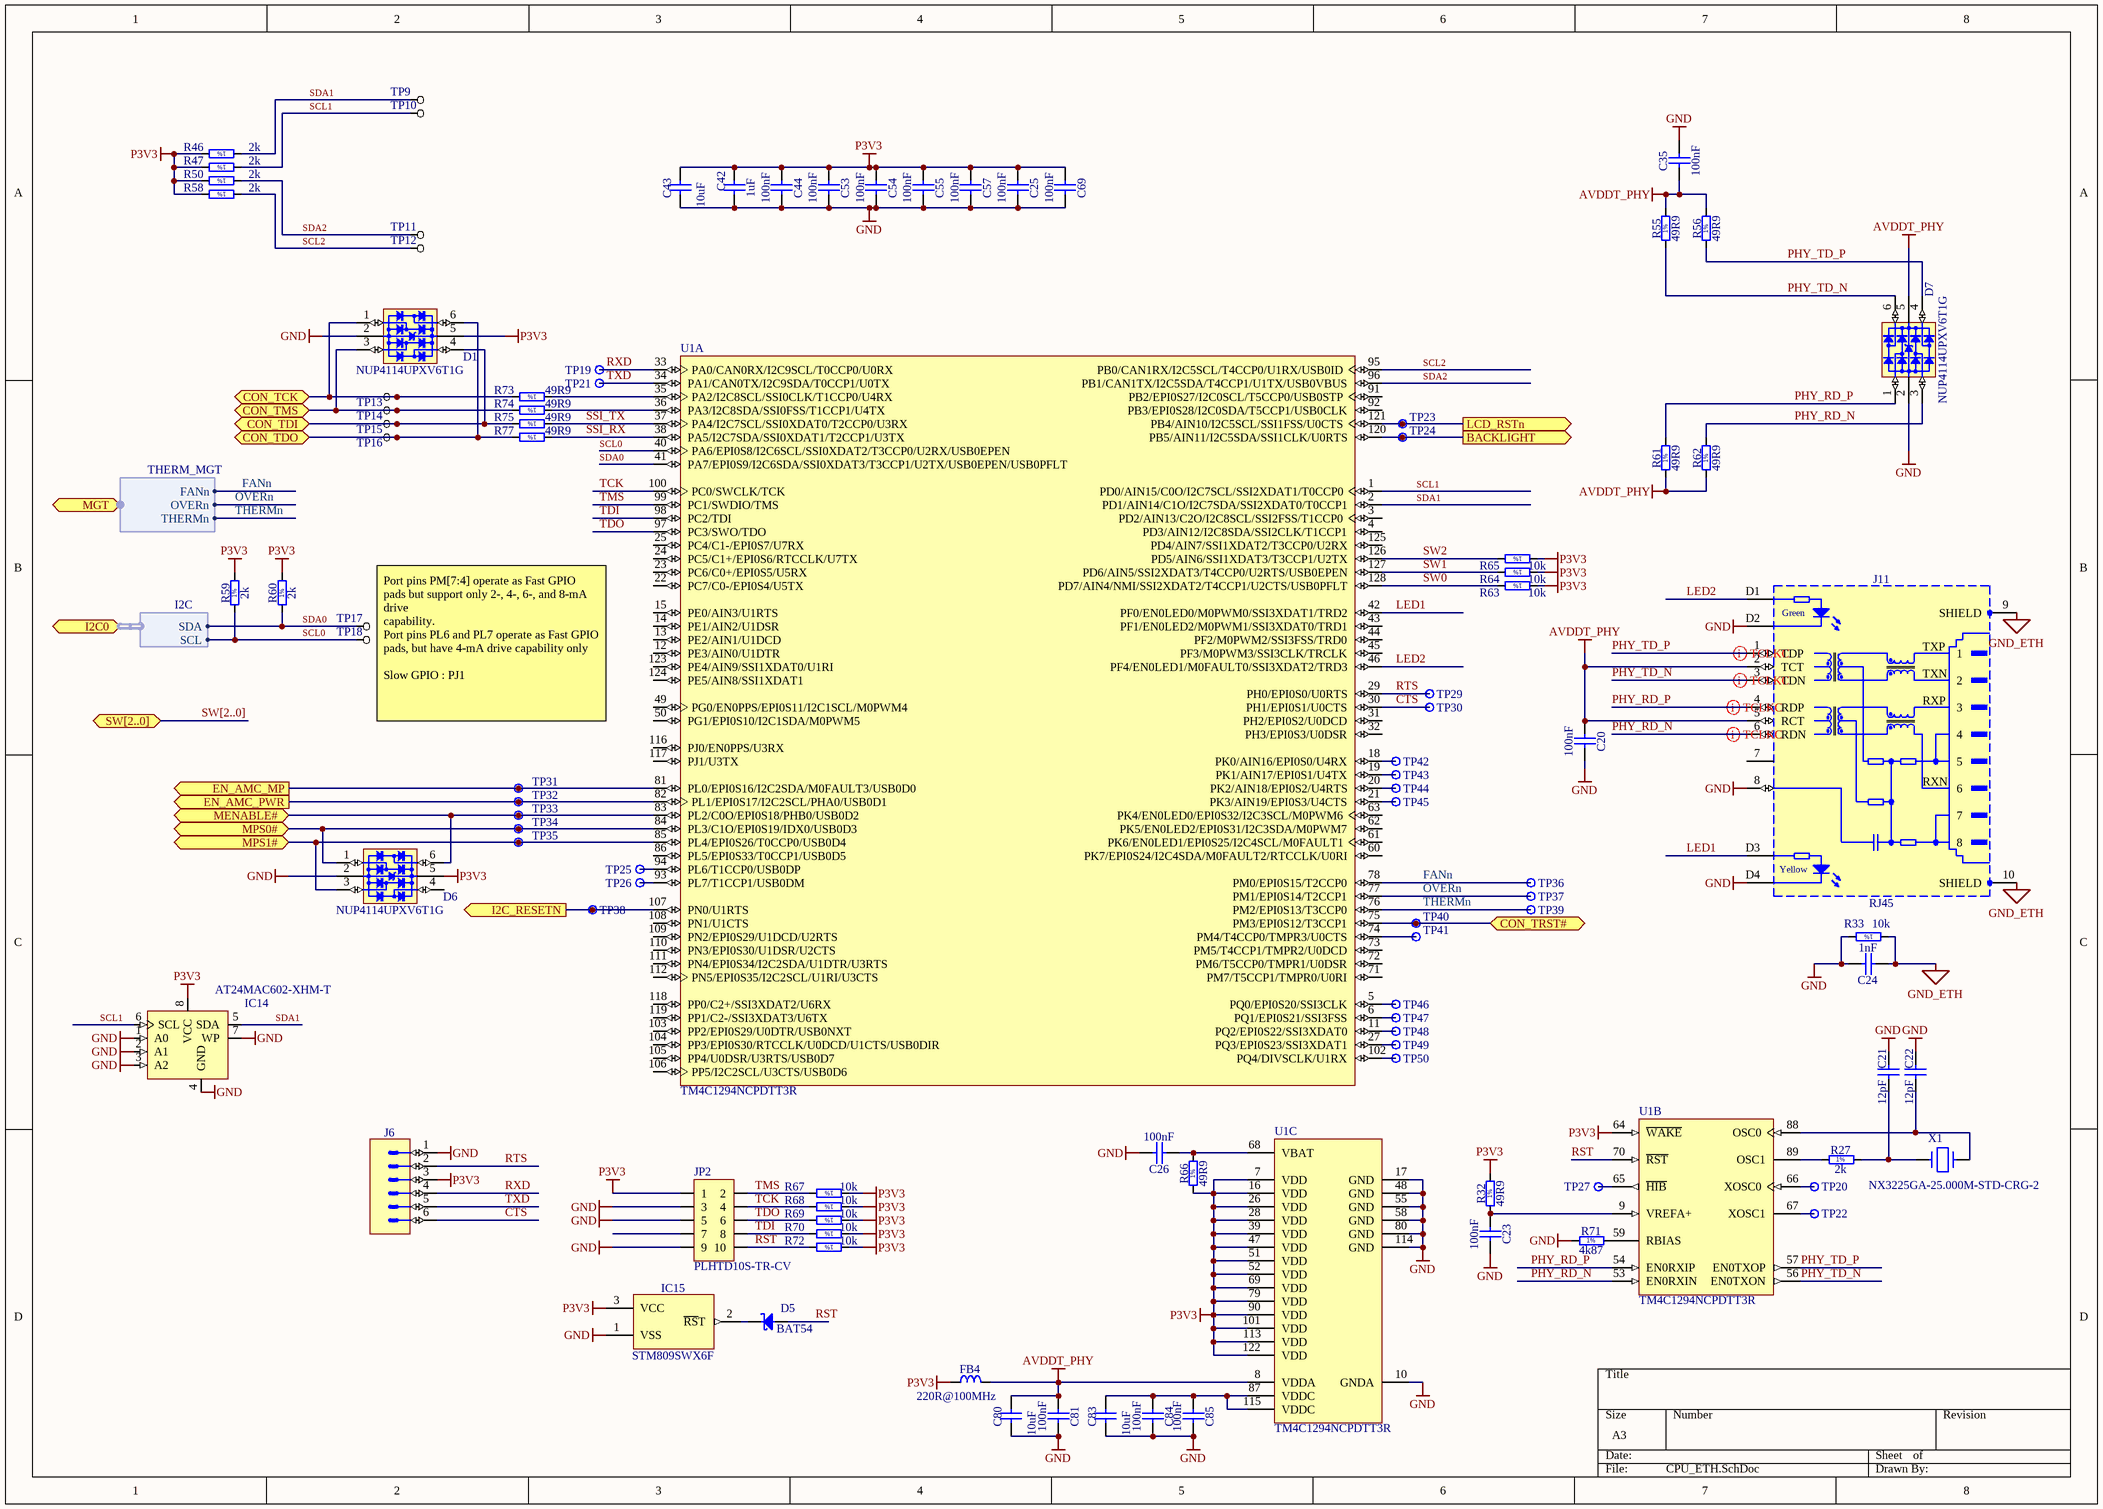
[diagram p7: CPU_ETH.SchDoc]

### Parts
(Parts that share a designator on the sheet are numbered #1, #2 ... from top to bottom, then left to right.)
C20  100nF  [CAPC1005X55N]
C21  12pF  [CAPC1005X55N]
C22  12pF  [CAPC1005X55N]
C23  100nF  [CAPC1005X55N]
C24  1nF  [CAPC1005X55N]
C25  100nF  [CAPC1005X55N]
C26  100nF  [CAPC1005X55N]
C35  100nF  [CAPC1005X55N]
C42  1uF  [CAPC1608X87N]
C43  10uF  [CAPC2012X135N]
C44  100nF  [CAPC1005X55N]
C53  100nF  [CAPC1005X55N]
C54  100nF  [CAPC1005X55N]
C55  100nF  [CAPC1005X55N]
C57  100nF  [CAPC1005X55N]
C69  100nF  [CAPC1005X55N]
C80  10uF  [CAPC2012X135N]
C81  100nF  [CAPC1005X55N]
C83  10uF  [CAPC2012X135N]
C84  100nF  [CAPC1005X55N]
C85  100nF  [CAPC1005X55N]
D1  NUP4114UPXV6T1G  [SOTFL50P160X60-6N]
D5  BAT54  [SOT95P240X130-3N]
D6  NUP4114UPXV6T1G  [SOTFL50P160X60-6N]
D7  NUP4114UPXV6T1G  [SOTFL50P160X60-6N]
FB4  220R@100MHz  [INDC2012X105N]
IC14  AT24MAC602-XHM-T  [TSSOP-8]
IC15  STM809SWX6F  [SOT95P237X112-3N]
J6  KK®  [MOLEX_22-27-2061]  (value not drawn)
J11  RJ45  [TYCO_5-6605308-1]
JP2  PLHTD10S-TR-CV  [PLHTD10S-TR-CV]
R27  2k  [RESC1005X40N]
R32  49R9  [RESC1005X40N]
R33  10k  [RESC1005X40N]
R46  2k  [RESC1005X40N]
R47  2k  [RESC1005X40N]
R50  2k  [RESC1005X40N]
R55  49R9  [RESC1005X40N]
R56  49R9  [RESC1005X40N]
R58  2k  [RESC1005X40N]
R59  2k  [RESC1005X40N]
R60  2k  [RESC1005X40N]
R61  49R9  [RESC1005X40N]
R62  49R9  [RESC1005X40N]
R63  10k  [RESC1005X40N]
R64  10k  [RESC1005X40N]
R65  10k  [RESC1005X40N]
R66  49R9  [RESC1005X40N]
R67  10k  [RESC1005X40N]
R68  10k  [RESC1005X40N]
R69  10k  [RESC1005X40N]
R70  10k  [RESC1005X40N]
R71  4k87  [RESC1005X40N]
R72  10k  [RESC1005X40N]
R73  49R9  [RESC1005X40N]
R74  49R9  [RESC1005X40N]
R75  49R9  [RESC1005X40N]
R77  49R9  [RESC1005X40N]
TP9  TP  [TP]  (value not drawn)
TP10  TP  [TP]  (value not drawn)
TP11  TP  [TP]  (value not drawn)
TP12  TP  [TP]  (value not drawn)
TP13  TP  [TP]  (value not drawn)
TP14  TP  [TP]  (value not drawn)
TP15  TP  [TP]  (value not drawn)
TP16  TP  [TP]  (value not drawn)
TP17  TP  [TP]  (value not drawn)
TP18  TP  [TP]  (value not drawn)
TP19  Test Point  [TPS127]  (value not drawn)
TP20  Test Point  [TPS127]  (value not drawn)
TP21  Test Point  [TPS127]  (value not drawn)
TP22  Test Point  [TPS127]  (value not drawn)
TP23  Test Point  [TPS127]  (value not drawn)
TP24  Test Point  [TPS127]  (value not drawn)
TP25  Test Point  [TPS127]  (value not drawn)
TP26  Test Point  [TPS127]  (value not drawn)
TP27  Test Point  [TPS127]  (value not drawn)
TP29  Test Point  [TPS127]  (value not drawn)
TP30  Test Point  [TPS127]  (value not drawn)
TP31  Test Point  [TPS127]  (value not drawn)
TP32  Test Point  [TPS127]  (value not drawn)
TP33  Test Point  [TPS127]  (value not drawn)
TP34  Test Point  [TPS127]  (value not drawn)
TP35  Test Point  [TPS127]  (value not drawn)
TP36  Test Point  [TPS127]  (value not drawn)
TP37  Test Point  [TPS127]  (value not drawn)
TP38  Test Point  [TPS127]  (value not drawn)
TP39  Test Point  [TPS127]  (value not drawn)
TP40  Test Point  [TPS127]  (value not drawn)
TP41  Test Point  [TPS127]  (value not drawn)
TP42  Test Point  [TPS127]  (value not drawn)
TP43  Test Point  [TPS127]  (value not drawn)
TP44  Test Point  [TPS127]  (value not drawn)
TP45  Test Point  [TPS127]  (value not drawn)
TP46  Test Point  [TPS127]  (value not drawn)
TP47  Test Point  [TPS127]  (value not drawn)
TP48  Test Point  [TPS127]  (value not drawn)
TP49  Test Point  [TPS127]  (value not drawn)
TP50  Test Point  [TPS127]  (value not drawn)
U1#1  TM4C1294NCPDTT3R  [PDT0128A_N]  (part A of 3)
U1#2  TM4C1294NCPDTT3R  [PDT0128A_N]  (parts B,C of 3)
X1  NX3225GA-25.000M-STD-CRG-2  [XTAL_5.0*3.2]

### Ports
BACKLIGHT (out), CON_TCK (bidir), CON_TDI (bidir), CON_TDO (bidir), CON_TMS (bidir), CON_TRST#, EN_AMC_MP (out), EN_AMC_PWR (out), I2C0 (harness I2C), I2C_RESETN (out), LCD_RSTn (out), MENABLE# (bidir), MGT (harness THERM_MGT), MPS0# (bidir), MPS1# (bidir), SW[2..0] (bidir)

### Harnesses
THERM_MGT: OVERn, THERMn, FANn
I2C: SCL, SDA

### Nets
AVDDT_PHY: C20.2 C35.1 C80.1 C81.2 D7.5(VBUS) FB4.2 J11.2(TCT) J11.5(RCT) R55.2 R56.2 R61.1 R62.1 U1#2.8(VDDA)
GND: C20.1 C21.2 C22.2 C23.1 C24.2 C25.1 C26.1 C35.2 C42.1 C43.2 C44.1 C53.1 C54.1 C55.1 C57.1 C69.1 C80.2 C81.1 C83.2 C84.1 C85.1 D1.2(GND) D6.2(GND) D7.2(GND) IC14.1(A0) IC14.2(A1) IC14.3(A2) IC14.4(GND) IC14.7(WP) IC15.1(VSS) J6.1 J11.8 J11.D2 J11.D4 JP2.3 JP2.5 JP2.9 R33.2 R71.1 U1#2.10(GNDA) U1#2.17(GND) U1#2.48(GND) U1#2.55(GND) U1#2.58(GND) U1#2.80(GND) U1#2.114(GND)
GND_ETH: C24.1 J11.9(SHIELD) J11.10(SHIELD) R33.1
P3V3: C25.2 C42.2 C43.1 C44.2 C53.2 C54.2 C55.2 C57.2 C69.2 D1.5(VBUS) D6.5(VBUS) FB4.1 IC14.8(VCC) IC15.3(VCC) J6.3 JP2.1 R32.2 R46.2 R47.2 R50.2 R58.2 R59.2 R60.2 R63.1 R64.1 R65.1 R66.1 R67.1 R68.1 R69.1 R70.1 R72.1 U1#2.7(VDD) U1#2.16(VDD) U1#2.26(VDD) U1#2.28(VDD) U1#2.39(VDD) U1#2.47(VDD) U1#2.51(VDD) U1#2.52(VDD) U1#2.64(~{WAKE}) U1#2.69(VDD) U1#2.79(VDD) U1#2.90(VDD) U1#2.101(VDD) U1#2.113(VDD) U1#2.122(VDD)
Backlight: TP24.1 U1#1.120(PB5/AIN11/I2C5SDA/SSI1CLK/U0RTS) ; port BACKLIGHT
CON_TCK: D1.1(I/O1) R73.2 TP13.1 ; port CON_TCK
CON_TDI: D1.4(I/O3) R75.2 TP15.1 ; port CON_TDI
CON_TDO: D1.6(I/O4) R77.2 TP16.1 ; port CON_TDO
CON_TMS: D1.3(I/O2) R74.2 TP14.1 ; port CON_TMS
CON_TRST#: TP40.1 U1#1.75(PM3/EPI0S12/T3CCP1) ; port CON_TRST#
CTS: J6.6 TP30.1 U1#1.30(PH1/EPI0S1/U0CTS)
EN_AMC_MP: TP31.1 U1#1.81(PL0/EPI0S16/I2C2SDA/M0FAULT3/USB0D0) ; port EN_AMC_MP
EN_AMC_PWR: TP32.1 U1#1.82(PL1/EPI0S17/I2C2SCL/PHA0/USB0D1) ; port EN_AMC_PWR
FANn: TP36.1 U1#1.78(PM0/EPI0S15/T2CCP0) ; port MGT.FANn
I2C_RESETn: TP38.1 U1#1.107(PN0/U1RTS) ; port I2C_RESETN
LCD_RSTn: TP23.1 U1#1.121(PB4/AIN10/I2C5SCL/SSI1FSS/U0CTS) ; port LCD_RSTn
LED1: J11.D3 U1#1.42(PF0/EN0LED0/M0PWM0/SSI3XDAT1/TRD2)
LED2: J11.D1 U1#1.46(PF4/EN0LED1/M0FAULT0/SSI3XDAT2/TRD3)
MENABLE#: D6.6(I/O4) TP33.1 U1#1.83(PL2/C0O/EPI0S18/PHB0/USB0D2) ; port MENABLE#
MPS0#: D6.1(I/O1) TP34.1 U1#1.84(PL3/C1O/EPI0S19/IDX0/USB0D3) ; port MPS0#
MPS1#: D6.3(I/O2) TP35.1 U1#1.85(PL4/EPI0S26/T0CCP0/USB0D4) ; port MPS1#
OVERn: TP37.1 U1#1.77(PM1/EPI0S14/T2CCP1) ; port MGT.OVERn
PHY_RD_N: D7.3(I/O2) J11.6(RDN) R62.2 U1#2.53(EN0RXIN)
PHY_RD_P: D7.1(I/O1) J11.4(RDP) R61.2 U1#2.54(EN0RXIP)
PHY_TD_N: D7.6(I/O4) J11.3(TDN) R55.1 U1#2.56(EN0TXON)
PHY_TD_P: D7.4(I/O3) J11.1(TDP) R56.1 U1#2.57(EN0TXOP)
RST: D5.1(A) JP2.10 R72.2 U1#2.70(~{RST})
RTS: J6.2 TP29.1 U1#1.29(PH0/EPI0S0/U0RTS)
RXD: J6.4 TP19.1 U1#1.33(PA0/CAN0RX/I2C9SCL/T0CCP0/U0RX)
SCL0: R59.1 TP18.1 U1#1.40(PA6/EPI0S8/I2C6SCL/SSI0XDAT2/T3CCP0/U2RX/USB0EPEN) ; port I2C0.SCL  [project net MSCL_L]
SCL1: IC14.6(SCL) R47.1 TP10.1 U1#1.1(PD0/AIN15/C0O/I2C7SCL/SSI2XDAT1/T0CCP0)
SCL2: R58.1 TP12.1 U1#1.95(PB0/CAN1RX/I2C5SCL/T4CCP0/U1RX/USB0ID)
SDA0: R60.1 TP17.1 U1#1.41(PA7/EPI0S9/I2C6SDA/SSI0XDAT3/T3CCP1/U2TX/USB0EPEN/USB0PFLT) ; port I2C0.SDA  [project net MSDA_L]
SDA1: IC14.5(SDA) R46.1 TP9.1 U1#1.2(PD1/AIN14/C1O/I2C7SDA/SSI2XDAT0/T0CCP1)
SDA2: R50.1 TP11.1 U1#1.96(PB1/CAN1TX/I2C5SDA/T4CCP1/U1TX/USB0VBUS)
SSI_RX: R77.1 U1#1.38(PA5/I2C7SDA/SSI0XDAT1/T2CCP1/U3TX)
SSI_TX: R75.1 U1#1.37(PA4/I2C7SCL/SSI0XDAT0/T2CCP0/U3RX)
SW0: R63.2 U1#1.128(PD7/AIN4/NMI/SSI2XDAT2/T4CCP1/U2CTS/USB0PFLT)
SW1: R64.2 U1#1.127(PD6/AIN5/SSI2XDAT3/T4CCP0/U2RTS/USB0EPEN)
SW2: R65.2 U1#1.126(PD5/AIN6/SSI1XDAT3/T3CCP1/U2TX)
TCK: JP2.4 R68.2 U1#1.100(PC0/SWCLK/TCK)
TDI: JP2.8 R70.2 U1#1.98(PC2/TDI)
TDO: JP2.6 R69.2 U1#1.97(PC3/SWO/TDO)
THERMn: TP39.1 U1#1.76(PM2/EPI0S13/T3CCP0) ; port MGT.THERMn
TMS: JP2.2 R67.2 U1#1.99(PC1/SWDIO/TMS)
TXD: J6.5 TP21.1 U1#1.34(PA1/CAN0TX/I2C9SDA/T0CCP1/U0TX)
NetC21_1: C21.1 R27.2 X1.1
NetC22_1: C22.1 U1#2.88(OSC0) X1.2
NetC23_2: C23.2 R32.1 U1#2.9(VREFA+)
NetC26_2: C26.2 R66.2 U1#2.68(VBAT)
NetC83_1: C83.1 C84.2 C85.2 U1#2.87(VDDC) U1#2.115(VDDC)
NetD5_3: D5.3(C) IC15.2(~{RS}T)
NetR27_1: R27.1 U1#2.89(OSC1)
NetR71_2: R71.2 U1#2.59(RBIAS)
NetR73_1: R73.1 U1#1.35(PA2/I2C8SCL/SSI0CLK/T1CCP0/U4RX)
NetR74_1: R74.1 U1#1.36(PA3/I2C8SDA/SSI0FSS/T1CCP1/U4TX)
NetTP20_1: TP20.1 U1#2.66(XOSC0)
NetTP22_1: TP22.1 U1#2.67(XOSC1)
NetTP25_1: TP25.1 U1#1.94(PL6/T1CCP0/USB0DP)
NetTP26_1: TP26.1 U1#1.93(PL7/T1CCP1/USB0DM)
NetTP27_1: TP27.1 U1#2.65(~{HIB})
NetTP41_1: TP41.1 U1#1.74(PM4/T4CCP0/TMPR3/U0CTS)
NetTP42_1: TP42.1 U1#1.18(PK0/AIN16/EPI0S0/U4RX)
NetTP43_1: TP43.1 U1#1.19(PK1/AIN17/EPI0S1/U4TX)
NetTP44_1: TP44.1 U1#1.20(PK2/AIN18/EPI0S2/U4RTS)
NetTP45_1: TP45.1 U1#1.21(PK3/AIN19/EPI0S3/U4CTS)
NetTP46_1: TP46.1 U1#1.5(PQ0/EPI0S20/SSI3CLK)
NetTP47_1: TP47.1 U1#1.6(PQ1/EPI0S21/SSI3FSS)
NetTP48_1: TP48.1 U1#1.11(PQ2/EPI0S22/SSI3XDAT0)
NetTP49_1: TP49.1 U1#1.27(PQ3/EPI0S23/SSI3XDAT1)
NetTP50_1: TP50.1 U1#1.102(PQ4/DIVSCLK/U1RX)

Not connected (* = marked no-connect by the designer): D6 4(I/O3); J11 7; JP2 7; U1#1 3(PD2/AIN13/C2O/I2C8SCL/SSI2FSS/T1CCP0) 4(PD3/AIN12/I2C8SDA/SSI2CLK/T1CCP1) 12(PE3/AIN0/U1DTR) 13(PE2/AIN1/U1DCD) 14(PE1/AIN2/U1DSR) 15(PE0/AIN3/U1RTS) 22(PC7/C0-/EPI0S4/U5TX) 23(PC6/C0+/EPI0S5/U5RX) 24(PC5/C1+/EPI0S6/RTCCLK/U7TX) 25(PC4/C1-/EPI0S7/U7RX) 31(PH2/EPI0S2/U0DCD) 32(PH3/EPI0S3/U0DSR) 43(PF1/EN0LED2/M0PWM1/SSI3XDAT0/TRD1) 44(PF2/M0PWM2/SSI3FSS/TRD0) 45(PF3/M0PWM3/SSI3CLK/TRCLK) 49(PG0/EN0PPS/EPI0S11/I2C1SCL/M0PWM4) 50(PG1/EPI0S10/I2C1SDA/M0PWM5) 60(PK7/EPI0S24/I2C4SDA/M0FAULT2/RTCCLK/U0RI) 61(PK6/EN0LED1/EPI0S25/I2C4SCL/M0FAULT1) 62(PK5/EN0LED2/EPI0S31/I2C3SDA/M0PWM7) 63(PK4/EN0LED0/EPI0S32/I2C3SCL/M0PWM6) 71(PM7/T5CCP1/TMPR0/U0RI) 72(PM6/T5CCP0/TMPR1/U0DSR) 73(PM5/T4CCP1/TMPR2/U0DCD) 86(PL5/EPI0S33/T0CCP1/USB0D5) 91(PB2/EPI0S27/I2C0SCL/T5CCP0/USB0STP) 92(PB3/EPI0S28/I2C0SDA/T5CCP1/USB0CLK) 103(PP2/EPI0S29/U0DTR/USB0NXT) 104(PP3/EPI0S30/RTCCLK/U0DCD/U1CTS/USB0DIR) 105(PP4/U0DSR/U3RTS/USB0D7) 106(PP5/I2C2SCL/U3CTS/USB0D6) 108(PN1/U1CTS) 109(PN2/EPI0S29/U1DCD/U2RTS) 110(PN3/EPI0S30/U1DSR/U2CTS) 111(PN4/EPI0S34/I2C2SDA/U1DTR/U3RTS) 112(PN5/EPI0S35/I2C2SCL/U1RI/U3CTS) 116(PJ0/EN0PPS/U3RX) 117(PJ1/U3TX) 118(PP0/C2+/SSI3XDAT2/U6RX) 119(PP1/C2-/SSI3XDAT3/U6TX) 123(PE4/AIN9/SSI1XDAT0/U1RI) 124(PE5/AIN8/SSI1XDAT1) 125(PD4/AIN7/SSI1XDAT2/T3CCP0/U2RX)

### Buses and harness runs
bus SW[2..0] = port SW[2..0]

### Layout directives
differential pair: PHY_RD_N, PHY_RD_P, PHY_TD_N, PHY_TD_P

### Notes on the sheet
- Port pins PM[7:4] operate as Fast GPIO pads but support only 2-, 4-, 6-, and 8-mA drive
  capability.
  Port pins PL6 and PL7 operate as Fast GPIO pads, but have 4-mA drive capability only
  Slow GPIO : PJ1
- (in symbol R0402_2K_1%_0.0625W_100PPM) 1%
- (in symbol R0402_4K87_1%_0.0625W_100PPM) 1%
- (in symbol R0402_10K_1%_0.0625W_100PPM) 1%
- (in symbol R0402_49R9_1%_0.0625W_100PPM) 1%
- (in symbol TYCO_5-6605308-1) Green; TXP; TXN; RXP; RXN; Yellow

### Library data of the parts
C20 C23 C25 C26 C35 C44 C53-C55 C57 C69 C81 C84 C85 = CC0402_100NF_16V_10%_X5R: as C6 on sheet IO; Part Number: CC0402_100NF_16V_10%_X5R; Component Kind: Standard; Component Type: Standard; Pin Count: 2; Value: 100nF; Status: None; Manufacturer Part Number: CC0402_100NF_16V_10%_X5R; Case: 0402; Mounted: Yes; Socket: No; SMD: Yes; Manufacturer1 Example: MURATA; Manufacturer1 ComponentHeight: 0.55mm; HelpURL: \\cern.ch\dfs\Applications\Altium\Datasheets\CC0402_X5R_MURATA_GRM.pdf; Author: CERN DEM JLC; CreateDate: 10.12.2013; LatestRevisionDate: 10.12.2013; Sense: No
C21 C22 = CC0402_12PF_50V_5%_C0G: Non-polarised capacitor; Part Description: SMD Multilayer Chip Ceramic Capacitor; Manufacturer: GENERIC; Manufacturer1 Part Number: C0402C120J5GACTU; Voltage: 50V; TC: C0G/NP0; Tolerance: ±5%; Part Number: CC0402_12PF_50V_5%_C0G; Component Kind: Standard; Component Type: Standard; Pin Count: 2; Value: 12pF; Status: Preferred; Manufacturer Part Number: CC0402_12PF_50V_5%_C0G; Case: 0402; Mounted: Yes; Socket: No; SMD: Yes; Sense: No; Manufacturer1 Example: KEMET; Manufacturer1 ComponentHeight: 0.55mm; HelpURL: \\cern.ch\dfs\Applications\Altium\Datasheets\CC0805_C0G_KEMET_(Commercial Grade).pdf; Author: CERN DEM JLC; CreateDate: 04.10.2016; LatestRevisionDate: 04.10.2016
C24 = CC0402_1NF_50V_10%_X7R: as C111 on sheet Thermal_MGT; Part Number: CC0402_1NF_50V_10%_X7R; Component Kind: Standard; Component Type: Standard; Pin Count: 2; Value: 1nF; Status: Not Recommended; Manufacturer Part Number: CC0402_1NF_50V_10%_X7R; Case: 0402; Mounted: Yes; Socket: No; SMD: Yes; Manufacturer1 Example: PHYCOMP; Manufacturer1 ComponentHeight: 0.55mm; HelpURL: \\cern.ch\dfs\Applications\Altium\Datasheets\CC0402_X7R_PHYCOMP.pdf; Author: CERN DEM JLC; CreateDate: 03.12.2007; LatestRevisionDate: 03.12.2007; Sense: No
C42 = CC0603_1UF_25V_10%_X7R: Non-polarised capacitor; Part Description: SMD Multilayer Chip Ceramic Capacitor; Manufacturer: GENERIC; Manufacturer1 Part Number: GRM188R71E105KA12D; Voltage: 25V; TC: X7R; Tolerance: ±10%; Table: Capacitors SMD; Part Number: CC0603_1UF_25V_10%_X7R; Component Kind: Standard; Component Type: Standard; Pin Count: 2; Value: 1uF; Status: None; Manufacturer Part Number: CC0603_1UF_25V_10%_X7R; Case: 0603; Mounted: Yes; Socket: No; SMD: Yes; Manufacturer1 Example: MURATA; Manufacturer1 ComponentHeight: 0.9mm; HelpURL: \\cern.ch\dfs\Applications\Altium\Datasheets\CC0603_X7R_MURATA.pdf; Author: CERN DEM JLC; CreateDate: 2011-01-18; LatestRevisionDate: 2011-01-18
C43 C80 C83 = CC0805_10UF_10V_10%_X7R: Non-polarised capacitor; Part Description: SMD Multilayer Chip Ceramic Capacitor; Manufacturer: GENERIC; Manufacturer1 Part Number: GRM21BR71A106KE51L; Voltage: 10V; TC: X7R; Tolerance: ±10%; Table: Capacitors SMD; Part Number: CC0805_10UF_10V_10%_X7R; Component Kind: Standard; Component Type: Standard; Pin Count: 2; Value: 10uF; Status: Preferred; Manufacturer Part Number: CC0805_10UF_10V_10%_X7R; Case: 0805; Mounted: Yes; Socket: No; SMD: Yes; Manufacturer1 Example: MURATA; Manufacturer1 ComponentHeight: 1.35mm; HelpURL: \\cern.ch\dfs\Applications\Altium\Datasheets\CC0805_X7R_MURATA.pdf; Author: CERN DEM JLC; CreateDate: 2012-04-30; LatestRevisionDate: 2012-04-30
D1 D6 D7 = NUP4114UPXV6T1G: Part Description: ESD Protection Diodes Array (8kV) with Low Clamping Voltage; Manufacturer: ON SEMICONDUCTOR; Voltage: 5.5V; PressFit: No; Bonding: No; Part Number: NUP4114UPXV6T1G; Component Kind: Standard; Component Type: Standard; Device: NUP4114UPXV6T1G; PackageDescription: SOTFL (SOT666, SOT563,), 0.50mm, Pitch; 6 Pin, 1.20mm W X 1.60mm L X 0.60mm H Body, IPC Medium Density; Manufacturer Part Number: NUP4114UPXV6T1G; Pin Count: 8; Mounted: Yes; Socket: No; SMD: Yes; Sense: No; ComponentHeight: 1.75mm; HelpURL: \\cern.ch\dfs\Applications\Altium\Datasheets\NUP4114UPXV6T1G.pdf; Author: CERN DEM JLC; CreateDate: 05.12.2012; LatestRevisionDate: 05.12.2012
D5 = BAT54: Diode Schottky  Anode Pin 1 Cathode Pin 3 (Pas de pin 2); Part Description: Single Small Signal Schottky Diode; Manufacturer: FAIRCHILD SEMICONDUCTOR; Voltage: 30V; Power: 200mA; Table: Diodes; Part Number: BAT54; Component Kind: Standard; Component Type: Standard; Device: BAT54; PackageDescription: SOT23 3-Leads, Pitch 0.95mm - Body 1.3x2.9mm, IPC Medium Density; Manufacturer Part Number: BAT54; Pin Count: 3; Case: SOT23-3; Mounted: Yes; Socket: No; SMD: Yes; ComponentHeight: 1.30mm; HelpURL: \\cern.ch\dfs\Applications\Altium\Datasheets\BAT54.pdf; Author: CERN DEM JLC; CreateDate: 2009-09-17; LatestRevisionDate: 2010-05-27
FB4 = IND0805_MURATA_BLM21PG221SN1D: Inductor; Part Description: SMD EMIFIL Suppression Chip Ferrite Bead; Manufacturer: MURATA; Power: 2A; Resistance: 0.05R; Tolerance: ±25%; Table: Inductors SMD; Part Number: IND0805_MURATA_BLM21PG221SN1D; Component Kind: Standard; Component Type: Standard; Pin Count: 2; Value: 220R@100MHz; Status: None; Manufacturer Part Number: BLM21PG221SN1D; Case: 0805; Mounted: Yes; Socket: No; SMD: Yes; ComponentHeight: 1.05mm; HelpURL: \\cern.ch\dfs\Applications\Altium\Datasheets\IND0402_MURATA_BLM21P.pdf; Author: CERN DEM JLC; CreateDate: 2010-01-25; LatestRevisionDate: 2010-01-25
IC14 = MEM_24MAC602: Serial 2K EEPROM+ 48bit MAC
IC15 = STM809SWX6F: 3-Pin Microprocessor Reset Circuit; Part Description: 3-Pin Microprocessor Reset Circuit, Reset Threshold Voltage 2.85-3.00V; Manufacturer: ST MICROELECTRONICS; PressFit: No; Bonding: No; Part Number: STM809SWX6F; Component Kind: Standard; Component Type: Standard; Device: STM809SWX6F; PackageDescription: SOT, 0.95mm, pitch; 3 pin,1.30mm W X 2.92mm L X 1.12mm H body, IPC Medium Density; Manufacturer Part Number: STM809SWX6F; Pin Count: 3; Case: SOT23; Mounted: Yes; Socket: No; SMD: Yes; Sense: No; ComponentHeight: 1.12mm; HelpURL: \\cern.ch\dfs\Applications\Altium\Datasheets\STM809SWX6F.pdf; Author: CERN DEM JMW; CreateDate: 11.08.2015; LatestRevisionDate: 11.08.2015
J6 = MOLEX_22-27-2061: Connector 6 Male; Part Description: 2.54mm (.100") Pitch KK® Wire-to-Board Header, Vertical, with Friction Lock, 6 Circuits, Tin (Sn) Plating; Manufacturer: MOLEX; PressFit: No; Part Number: MOLEX_22-27-2061; Component Kind: Standard; Component Type: Standard; Pin Count: 6; Family: KK®; Mounted: Yes; Socket: No; SMD: No; Sense: No; Status: None; Manufacturer Part Number: 22-27-2061; ComponentHeight: 11.7mm; HelpURL: \\cern.ch\dfs\Applications\Altium\Datasheets\MOLEX_22-27-2061.pdf; Author: CERN DEM JMW; CreateDate: 30.11.2011; LatestRevisionDate: 30.11.2011
J11 = TYCO_5-6605308-1: 1 Port, Yellow/Green LEDs, RJ45 10/100Base-T Ethernet, Mag45 Connector Module With Integrated Magnetics; Manufacturer: TYCO ELECTRONICS; PressFit: No; Part Number: TYCO_5-6605308-1; Component Kind: Standard; Component Type: Standard; Pin Count: 14; Family: RJ45; Mounted: Yes; Socket: No; SMD: No; Sense: No; Status: None; Part Description: 1 Port, Yellow/Green LEDs, RJ45 10/100Base-T Ethernet, Mag45 Connector Module With Integrated Magnetics; Manufacturer Part Number: 5-6605308-1; ComponentHeight: 15.24mm; HelpURL: \\cern.ch\dfs\Applications\Altium\Datasheets\TYCO_5-6605308-1.pdf; Author: CERN DEM JLC; CreateDate: 23.08.2012; LatestRevisionDate: 23.08.2012
JP2 = CON_2x5 1.27 SMT Male: 1.27 mm dual row goldpin (Maritex)
R27 R46 R47 R50 R58-R60 = R0402_2K_1%_0.0625W_100PPM: as R184 on sheet I2C_SW; Part Number: R0402_2K_1%_0.0625W_100PPM; Component Kind: Standard; Component Type: Standard; Pin Count: 2; Value: 2k; Status: Not Recommended; Power: 0.0625W; Tolerance: ±1%; Manufacturer Part Number: R0402_2K_1%_0.0625W_100PPM; Case: 0402; Mounted: Yes; Sense: No; Socket: No; SMD: Yes; Manufacturer1 Example: YAGEO PHYCOMP; Manufacturer1 ComponentHeight: 0.4mm; HelpURL: \\cern.ch\dfs\Applications\Altium\Datasheets\R0402_Phycomp_RC0402.pdf; Author: CERN DEM JLC; CreateDate: 03.12.2007; LatestRevisionDate: 17.10.2012
R32 R55 R56 R61 R62 R66 R73-R75 R77 = R0402_49R9_1%_0.0625W_100PPM: as R38 on sheet Thermal_MGT; Part Number: R0402_49R9_1%_0.0625W_100PPM; Component Kind: Standard; Component Type: Standard; Pin Count: 2; Value: 49R9; Status: Not recommended; Power: 0.0625W; Tolerance: ±1%; Manufacturer Part Number: R0402_49R9_1%_0.0625W_100PPM; Case: 0402; Mounted: Yes; Socket: No; SMD: Yes; Manufacturer1 Example: YAGEO PHYCOMP; Manufacturer1 ComponentHeight: 0.4mm; HelpURL: \\cern.ch\dfs\Applications\Altium\Datasheets\R0402_Phycomp_RC0402.pdf; Author: CERN DEM JLC; CreateDate: 2012-10-24; LatestRevisionDate: 2012-10-24
R33 R63-R65 R67-R70 R72 = R0402_10K_1%_0.0625W_100PPM: as R197 on sheet I2C_SW; Part Number: R0402_10K_1%_0.0625W_100PPM; Component Kind: Standard; Component Type: Standard; Pin Count: 2; Value: 10k; Status: Not recommended; Power: 0.0625W; Tolerance: ±1%; Manufacturer Part Number: R0402_10K_1%_0.0625W_100PPM; Case: 0402; Mounted: Yes; Socket: No; SMD: Yes; Manufacturer1 Example: YAGEO PHYCOMP; Manufacturer1 ComponentHeight: 0.4mm; HelpURL: \\cern.ch\dfs\Applications\Altium\Datasheets\R0402_Phycomp_RC0402.pdf; Author: CERN DEM JLC; CreateDate: 2007-12-03; LatestRevisionDate: 2012-10-17
R71 = R0402_4K87_1%_0.0625W_100PPM: Resistor - 1%; Part Description: General Purpose Thick Film Chip Resistor; Manufacturer: GENERIC; Manufacturer1 Part Number: CRCW04024K87FKED; TC: ±100ppm/°C; PressFit: No; Part Number: R0402_4K87_1%_0.0625W_100PPM; Component Kind: Standard; Component Type: Standard; Pin Count: 2; Value: 4k87; Status: None; Power: 0.0625W; Tolerance: ±1%; Manufacturer Part Number: R0402_4K87_1%_0.0625W_100PPM; Case: 0402; Mounted: Yes; Sense: No; Socket: No; SMD: Yes; Manufacturer1 Example: VISHAY; Manufacturer1 ComponentHeight: 0.4mm; HelpURL: \\cern.ch\dfs\Applications\Altium\Datasheets\R0402_VISHAY_CRCW e3.pdf; Author: CERN DEM JLC; CreateDate: 04.11.2014; LatestRevisionDate: 04.11.2014
TP9-TP18 = TP: Testpoint
TP19-TP27 TP29-TP50 = SMD_PAD_1.27X1.27MM: Part Description: 1.27mm x 1.27mm PCB Copper Area (SMD Test Point); Mounted: No; Part Number: SMD_PAD_1.27X1.27MM; Component Kind: Standard (No BOM); Component Type: Standard (No BOM); Pin Count: 1; Family: Test Point; Socket: No; SMD: Yes; Sense: No; Status: None; ComponentHeight: 0mm; HelpURL: Undefined; Author: CERN DEM JLC; CreateDate: 12.01.2008; LatestRevisionDate: 12.01.2008; PackageDescription: 1.27mm x 1.27mm PCB Copper Area (SMD Test Point)
U1#1 U1#2 = CMP-0945-00009-2: Tiva C Series Microcontroller, 1024 KB Flash, 256 KB SRAM, 12 Bit, 20 Channels, -40 to 105 degC, 128-Pin TQFP (PDT), Green (RoHS & no Sb/Br), Tape and Reel; Manufacturer: Texas Instruments; ADC Resolution: 12 Bits; Max Speed: 120 MHz; ADC Channels: 20; CPU: ARM Cortex-M4; Flash: 1024 KB; SRAM: 256 KB; ComponentLink3URL: http://www.ti.com/lit/ml/mpqf013/mpqf013.pdf; ComponentLink3Description: Package Specification; ComponentLink2URL: http://www.ti.com/lit/ds/symlink/tm4c1294ncpdt.pdf; Packing: Tape and Reel; ComponentLink1URL: http://www.ti.com/; Temperature Range: -40 to 105 degC; PackageReference: PDT0128A; PackageVersion: 4087726/A; ComponentLink2Description: Datasheet; PartNumber: TM4C1294NCPDTT3R; ComponentLink1Description: Manufacturer URL; PackageDescription: 128-Pin Thin Quad Flat Package, Body 14 x 14 mm, Pitch 0.4 mm; DatasheetVersion: 15863.2743; Eco-Plan: Green (RoHS & no Sb/Br); Mounting Technology: Surface Mount
X1 = X_CRYSTAL_SMD_5.0*3.2_25M: miniature crystal oscillator; Supplier 1: Farnell

## Sheet LCD.SchDoc
size A4
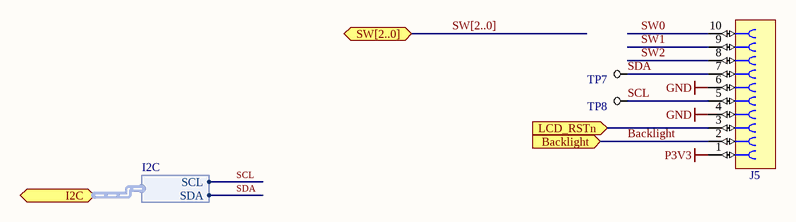
[diagram p8: LCD.SchDoc]

### Parts
J5  FFC  [WURTH_686 110 144 22]  (value not drawn)
TP7  TP  [TP]  (value not drawn)
TP8  TP  [TP]  (value not drawn)

### Ports
Backlight (in), I2C (harness I2C), LCD_RSTn (in), SW[2..0] (bidir)

### Harnesses
I2C: SCL, SDA

### Nets
GND: J5.4 J5.6
P3V3: J5.1
Backlight: J5.2 ; port Backlight
LCD_RSTn: J5.3 ; port LCD_RSTn
SCL: J5.5 TP8.1 ; port I2C.SCL  [project net I2CD.SCL]
SDA: J5.7 TP7.1 ; port I2C.SDA  [project net I2CD.SDA]
SW0: J5.10
SW1: J5.9
SW2: J5.8

### Buses and harness runs
bus SW[2..0] = port SW[2..0]

### Library data of the parts
J5 = WURTH_686 110 144 22: Connector 10 Female; Part Description: 10 Contacts, Pitch 1mm, SMT Connector, ZIF Horizontal Bottom Contact WR-FPC; Manufacturer: WURTH ELEKTRONIK; PressFit: No; Part Number: WURTH_686 110 144 22; Component Kind: Standard; Component Type: Standard; Pin Count: 10; Family: FFC; Mounted: Yes; Socket: No; SMD: Yes; Sense: No; Status: None; Manufacturer Part Number: 686 110 144 22; ComponentHeight: 3.15mm; HelpURL: \\cern.ch\dfs\Applications\Altium\Datasheets\WURTH_686 110 144 22.pdf; Author: CERN DEM JMW; CreateDate: 06.08.2015; LatestRevisionDate: 06.08.2015
TP7 TP8 = TP: Testpoint

## Nets that join several sheets
GND: AMC_BOX_Panel (107 pins), Supply (30 pins), U_SFP (18 pins), U_SFP (18 pins), clocking (11 pins), U_IO (17 pins), U_SFP (18 pins), U_SFP (18 pins), U_SFP (18 pins), U_SFP (18 pins), I2C_SW (5 pins), Thermal_MGT (9 pins), CPU_ETH (46 pins), LCD (J5.4 J5.6), U_IO (17 pins)
P3V3: Supply (20 pins), U_SFP (13 pins), U_SFP (13 pins), clocking (FB2.1), U_IO (12 pins), U_SFP (13 pins), U_SFP (13 pins), U_SFP (13 pins), U_SFP (13 pins), I2C_SW (20 pins), Thermal_MGT (7 pins), CPU_ETH (47 pins), LCD (J5.1), U_IO (12 pins)
P12V: Supply (19 pins), Thermal_MGT (6 pins)
AMC_MP: AMC_BOX_Panel (JMP4.9), Supply (T6.3)
AMC_PWR: AMC_BOX_Panel (B11.1), Supply (T4.5 T4.6 T4.7 T4.8)
Backlight: CPU_ETH (TP24.1 U1#1.120), LCD (J5.2)
CLK0_N: AMC_BOX_Panel (JMP4.5), clocking (OSC1.4)
CLK0_P: AMC_BOX_Panel (JMP4.4), clocking (OSC1.5)
CON_TCK: AMC_BOX_Panel (JMP8.9), CPU_ETH (D1.1 R73.2 TP13.1)
CON_TDI: AMC_BOX_Panel (JMP8.8), CPU_ETH (D1.4 R75.2 TP15.1)
CON_TDO: AMC_BOX_Panel (JMP8.7), CPU_ETH (D1.6 R77.2 TP16.1)
CON_TMS: AMC_BOX_Panel (JMP8.6), CPU_ETH (D1.3 R74.2 TP14.1)
CON_TRST#: AMC_BOX_Panel (J14.36), CPU_ETH (TP40.1 U1#1.75)
EN_AMC_MP: Supply (R54.2 T8.1), CPU_ETH (TP31.1 U1#1.81)
EN_AMC_PWR: Supply (R111.2 T5.1), CPU_ETH (TP32.1 U1#1.82)
FANn: Thermal_MGT (IC1.5 R154.2), CPU_ETH (TP36.1 U1#1.78)
I2C_RESETn: I2C_SW (IC16.24 R197.1), CPU_ETH (TP38.1 U1#1.107)
I2CA.SCL: U_SFP (CON20F.5 IC3F.14), I2C_SW (IC16.2 R185.1)
I2CA.SDA: U_SFP (CON20F.4 IC3F.15), I2C_SW (IC16.1 R184.1)
I2CB.SCL: U_SFP (CON20E.5 IC3E.14), I2C_SW (IC16.4 R187.1)
I2CB.SDA: U_SFP (CON20E.4 IC3E.15), I2C_SW (IC16.3 R186.1)
I2CC.SCL: U_SFP (CON20B.5 IC3B.14), I2C_SW (IC16.6 R189.1)
I2CC.SDA: U_SFP (CON20B.4 IC3B.15), I2C_SW (IC16.5 R188.1)
I2CD.SCL: I2C_SW (IC16.8 R191.1), LCD (J5.5 TP8.1)
I2CD.SDA: I2C_SW (IC16.7 R190.1), LCD (J5.7 TP7.1)
I2CE.SCL: U_SFP (CON20D.5 IC3D.14), I2C_SW (IC16.11 R199.1)
I2CE.SDA: U_SFP (CON20D.4 IC3D.15), I2C_SW (IC16.10 R198.1)
I2CF.SCL: U_SFP (CON20C.5 IC3C.14), I2C_SW (IC16.13 R201.1)
I2CF.SDA: U_SFP (CON20C.4 IC3C.15), I2C_SW (IC16.12 R200.1)
I2CG.SCL: U_SFP (CON20A.5 IC3A.14), I2C_SW (IC16.15 R203.1)
I2CG.SDA: U_SFP (CON20A.4 IC3A.15), I2C_SW (IC16.14 R202.1)
I2CH.SCL: I2C_SW (IC16.17 R205.1), Thermal_MGT (IC1.16)
I2CH.SDA: I2C_SW (IC16.16 R204.1), Thermal_MGT (IC1.15)
LCD_RSTn: CPU_ETH (TP23.1 U1#1.121), LCD (J5.3)
LVDS0_N: AMC_BOX_Panel (J14.16), U_IO (D3B.1 IC2B.4 R22B.1 R40B.2)
LVDS0_N: AMC_BOX_Panel (J14.32), U_IO (D3A.1 IC2A.4 R22A.1 R40A.2)
LVDS0_P: AMC_BOX_Panel (J14.17), U_IO (D3B.6 IC2B.3 R22B.2 R39B.2)
LVDS0_P: AMC_BOX_Panel (J14.33), U_IO (D3A.6 IC2A.3 R22A.2 R39A.2)
LVDS1_N: AMC_BOX_Panel (J14.12), U_IO (D3B.3 IC4B.4 R24B.1 R44B.2)
LVDS1_N: AMC_BOX_Panel (J14.28), U_IO (D3A.3 IC4A.4 R24A.1 R44A.2)
LVDS1_P: AMC_BOX_Panel (J14.13), U_IO (D3B.4 IC4B.3 R24B.2 R41B.2)
LVDS1_P: AMC_BOX_Panel (J14.29), U_IO (D3A.4 IC4A.3 R24A.2 R41A.2)
LVDS2_N: AMC_BOX_Panel (J14.8), U_IO (D4B.1 IC11B.3 R26B.1 R43B.2)
LVDS2_N: AMC_BOX_Panel (J14.24), U_IO (D4A.1 IC11A.3 R26A.1 R43A.2)
LVDS2_P: AMC_BOX_Panel (J14.9), U_IO (D4B.6 IC11B.4 R26B.2 R42B.2)
LVDS2_P: AMC_BOX_Panel (J14.25), U_IO (D4A.6 IC11A.4 R26A.2 R42A.2)
LVDS3_N: AMC_BOX_Panel (J14.4), U_IO (D4B.3 IC13B.3 R15B.2 R31B.1)
LVDS3_N: AMC_BOX_Panel (J14.20), U_IO (D4A.3 IC13A.3 R15A.2 R31A.1)
LVDS3_P: AMC_BOX_Panel (J14.5), U_IO (D4B.4 IC13B.4 R14B.2 R31B.2)
LVDS3_P: AMC_BOX_Panel (J14.21), U_IO (D4A.4 IC13A.4 R14A.2 R31A.2)
MENABLE#: AMC_BOX_Panel (JMP4.6), CPU_ETH (D6.6 TP33.1 U1#1.83)
MPS0#: AMC_BOX_Panel (JMP4.8), CPU_ETH (D6.1 TP34.1 U1#1.84)
MPS1#: AMC_BOX_Panel (JMP4.7), CPU_ETH (D6.3 TP35.1 U1#1.85)
MSCL_L: AMC_BOX_Panel (JMP4.3), I2C_SW (IC16.19), CPU_ETH (R59.1 TP18.1 U1#1.40)
MSDA_L: AMC_BOX_Panel (JMP4.2), I2C_SW (IC16.20), CPU_ETH (R60.1 TP17.1 U1#1.41)
OVERn: Thermal_MGT (IC1.14 R153.2), CPU_ETH (TP37.1 U1#1.77)
QSFP_RX1_N: AMC_BOX_Panel (JMP6.10), U_SFP (CON20B.12)
QSFP_RX1_P: AMC_BOX_Panel (JMP6.11), U_SFP (CON20B.13)
QSFP_RX2_N: AMC_BOX_Panel (JMP6.2), U_SFP (CON20A.12)
QSFP_RX2_P: AMC_BOX_Panel (JMP6.3), U_SFP (CON20A.13)
QSFP_RX3_N: AMC_BOX_Panel (JMP8.10), U_SFP (CON20D.12)
QSFP_RX3_P: AMC_BOX_Panel (JMP8.11), U_SFP (CON20D.13)
QSFP_RX4_N: AMC_BOX_Panel (JMP8.2), U_SFP (CON20C.12)
QSFP_RX4_P: AMC_BOX_Panel (JMP8.3), U_SFP (CON20C.13)
QSFP_TX1_N: AMC_BOX_Panel (JMP6.13), U_SFP (CON20B.19)
QSFP_TX1_P: AMC_BOX_Panel (JMP6.12), U_SFP (CON20B.18)
QSFP_TX2_N: AMC_BOX_Panel (JMP6.5), U_SFP (CON20A.19)
QSFP_TX2_P: AMC_BOX_Panel (JMP6.4), U_SFP (CON20A.18)
QSFP_TX3_N: AMC_BOX_Panel (JMP8.13), U_SFP (CON20D.19)
QSFP_TX3_P: AMC_BOX_Panel (JMP8.12), U_SFP (CON20D.18)
QSFP_TX4_N: AMC_BOX_Panel (JMP8.5), U_SFP (CON20C.19)
QSFP_TX4_P: AMC_BOX_Panel (JMP8.4), U_SFP (CON20C.18)
RX_N: AMC_BOX_Panel (JMP2.2), U_SFP (CON20E.12)
RX_N: AMC_BOX_Panel (JMP2.10), U_SFP (CON20F.12)
RX_P: AMC_BOX_Panel (JMP2.3), U_SFP (CON20E.13)
RX_P: AMC_BOX_Panel (JMP2.11), U_SFP (CON20F.13)
SFP1_Tx0_N: AMC_BOX_Panel (JMP2.13), U_SFP (CON20F.19)
SFP1_Tx0_P: AMC_BOX_Panel (JMP2.12), U_SFP (CON20F.18)
SFP2_Tx1_N: AMC_BOX_Panel (JMP2.5), U_SFP (CON20E.19)
SFP2_Tx1_P: AMC_BOX_Panel (JMP2.4), U_SFP (CON20E.18)
SMA_CLKA_N: AMC_BOX_Panel (JMP4.12), clocking (TR1.6)
SMA_CLKA_P: AMC_BOX_Panel (JMP4.13), clocking (TR1.4)
SMA_CLKB_N: AMC_BOX_Panel (JMP4.10), clocking (TR2.6)
SMA_CLKB_P: AMC_BOX_Panel (JMP4.11), clocking (TR2.4)
SW0: CPU_ETH (R63.2 U1#1.128), LCD (J5.10)
SW1: CPU_ETH (R64.2 U1#1.127), LCD (J5.9)
SW2: CPU_ETH (R65.2 U1#1.126), LCD (J5.8)
THERMn: Thermal_MGT (IC1.6 R152.2), CPU_ETH (TP39.1 U1#1.76)

## Assembly variants
RS232: not fitted R8A R8B R9A R9B R10A R10B R11A R11B R12A R12B R13A R13B R14A R14B R15A R15B